# EAGLE design Board (EAGLE 9.5.2)
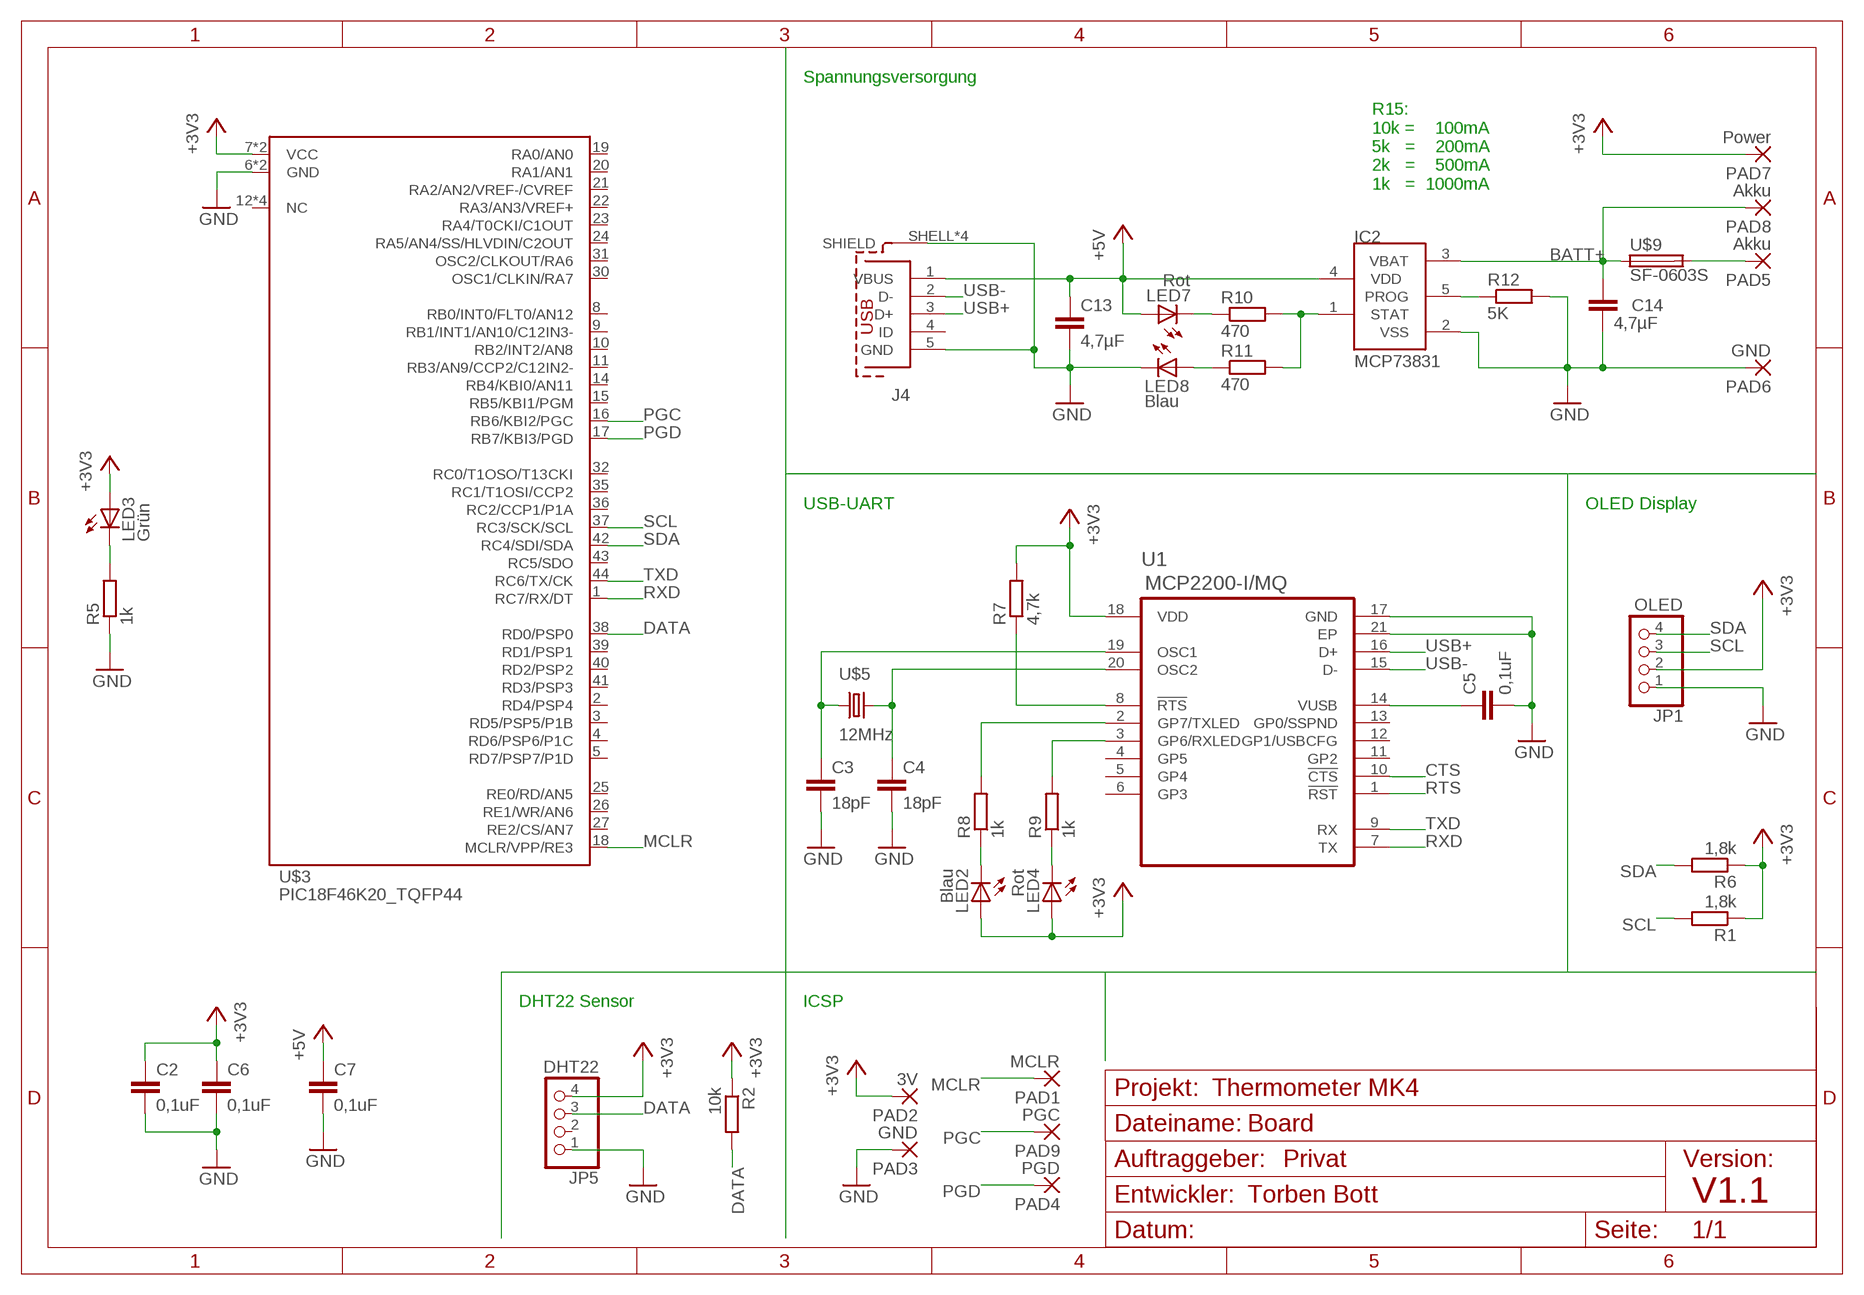
[diagram p0: schematic, sheet 1]

## Parts
C2  0,1uF  C-EUC0805  [C0805]
C3  18pF  C-EUC0805  [C0805]
C4  18pF  C-EUC0805  [C0805]
C5  0,1uF  C-EUC0805  [C0805]
C6  0,1uF  C-EUC0805  [C0805]
C7  0,1uF  C-EUC0805  [C0805]
C13  4,7µF  C-EUC0805  [C0805]
C14  4,7µF  C-EUC0805  [C0805]
IC2  MCP73831  [SOT23-5L]
J4  629105136821  [629105136821]
JP1  OLED  PINHD-1X4  [1X04]
JP5  DHT22  PINHD-1X4  [1X04]
LED2  Blau  LEDCHIPLED_0805  [CHIPLED_0805]
LED3  Grün  LEDCHIPLED_0805  [CHIPLED_0805]
LED4  Rot  LEDCHIPLED_0805  [CHIPLED_0805]
LED7  Rot  LEDCHIPLED_0805  [CHIPLED_0805]
LED8  Blau  LEDCHIPLED_0805  [CHIPLED_0805]
PAD1  MCLR  WIREPADSMD1,27-254  [SMD1,27-2,54]
PAD2  3V  WIREPADSMD1,27-254  [SMD1,27-2,54]
PAD3  GND  WIREPADSMD1,27-254  [SMD1,27-2,54]
PAD4  PGD  WIREPADSMD1,27-254  [SMD1,27-2,54]
PAD5  Akku  WIREPADSMD5-1,8  [5-1,8]
PAD6  GND  WIREPADSMD5-1,8  [5-1,8]
PAD7  Power  WIREPADSMD5-1,8  [5-1,8]
PAD8  Akku  WIREPADSMD5-1,8  [5-1,8]
PAD9  PGC  WIREPADSMD1,27-254  [SMD1,27-2,54]
R1  1,8k  R-EU_R0805  [R0805]
R2  10k  R-EU_R0805  [R0805]
R5  1k  R-EU_R0805  [R0805]
R6  1,8k  R-EU_R0805  [R0805]
R7  4,7k  R-EU_R0805  [R0805]
R8  1k  R-EU_R0805  [R0805]
R9  1k  R-EU_R0805  [R0805]
R10  470  R-EU_R0805  [R0805]
R11  470  R-EU_R0805  [R0805]
R12  5K  R-EU_R0805  [R0805]
U1  MCP2200-I/MQ  [QFN65P500X500X100-21N]
U$3  PIC18F46K20_TQFP44  [TQFP44]
U$5  12MHz  SMD_QUARZ_7M_SERIE  [7M_SERIES]
U$9  SF-0603S  [R0603]

## Nets
+3V3: C2.1 C6.1 JP1.2 JP5.4 LED2.A LED3.A LED4.A PAD2.1(P) PAD7.1(P) R1.1 R2.1 R6.1 R7.2 U1.18(VDD) U$3.7(VCC) U$3.28(VCC)
+5V: C7.1 C13.1 IC2.4(VDD) J4.1(VBUS) LED7.A
BATT+: C14.1 IC2.3(VBAT) PAD8.1(P) U$9.1
CTS: U1.10(!CTS)
DATA: JP5.3 R2.2 U$3.38(RD0/PSP0)
GND: C2.2 C3.2 C4.2 C5.2 C6.2 C7.2 C13.2 C14.2 IC2.2(VSS) J4.5(GND) J4.SHELL1(SHIELD) J4.SHELL2(SHIELD) J4.SHELL3(SHIELD) J4.SHELL(SHIELD) JP1.1 JP5.1 LED8.C PAD3.1(P) PAD6.1(P) R5.1 R12.2 U1.17(GND) U1.21(EP) U$3.6(GND) U$3.29(GND)
MCLR: PAD1.1(P) U$3.18(MCLR/VPP/RE3)
N$7: C4.1 U1.20(OSC2) U$5.3
N$8: LED3.C R5.2
N$9: C3.1 U1.19(OSC1) U$5.1
N$11: R7.1 U1.8(!RTS)
N$13: R8.2 U1.2(GP7/TXLED)
N$14: R9.2 U1.3(GP6/RXLED)
N$15: C5.1 U1.14(VUSB)
N$16: LED2.C R8.1
N$17: LED4.C R9.1
N$28: IC2.1(STAT) R10.2 R11.2
N$29: LED7.C R10.1
N$30: LED8.A R11.1
N$31: IC2.5(PROG) R12.1
N$35: PAD5.1(P) U$9.2
PGC: PAD9.1(P) U$3.16(RB6/KBI2/PGC)
PGD: PAD4.1(P) U$3.17(RB7/KBI3/PGD)
RTS: U1.1(!RST)
RXD: U1.7(TX) U$3.1(RC7/RX/DT)
SCL: JP1.3 R1.2 U$3.37(RC3/SCK/SCL)
SDA: JP1.4 R6.2 U$3.42(RC4/SDI/SDA)
TXD: U1.9(RX) U$3.44(RC6/TX/CK)
USB+: J4.3(D+) U1.16(D+)
USB-: J4.2(D-) U1.15(D-)
Unconnected: J4.4(ID) JP5.2 U1.4(GP5) U1.5(GP4) U1.6(GP3) U1.11(GP2) U1.12(GP1/USBCFG) U1.13(GP0/SSPND) U$3.2(RD4/PSP4) U$3.3(RD5/PSP5/P1B) U$3.4(RD6/PSP6/P1C) U$3.5(RD7/PSP7/P1D) U$3.8(RB0/INT0/FLT0/AN12) U$3.9(RB1/INT1/AN10/C12IN3-) U$3.10(RB2/INT2/AN8) U$3.11(RB3/AN9/CCP2/C12IN2-) U$3.12(NC) U$3.13(NC) U$3.14(RB4/KBI0/AN11) U$3.15(RB5/KBI1/PGM) U$3.19(RA0/AN0) U$3.20(RA1/AN1) U$3.21(RA2/AN2/VREF-/CVREF) U$3.22(RA3/AN3/VREF+) U$3.23(RA4/T0CKI/C1OUT) U$3.24(RA5/AN4/SS/HLVDIN/C2OUT) U$3.25(RE0/RD/AN5) U$3.26(RE1/WR/AN6) U$3.27(RE2/CS/AN7) U$3.30(OSC1/CLKIN/RA7) U$3.31(OSC2/CLKOUT/RA6) U$3.32(RC0/T1OSO/T13CKI) U$3.33(NC) U$3.34(NC) U$3.35(RC1/T1OSI/CCP2) U$3.36(RC2/CCP1/P1A) U$3.39(RD1/PSP1) U$3.40(RD2/PSP2) U$3.41(RD3/PSP3) U$3.43(RC5/SDO)

## Notes on the sheet
- Spannungsversorgung
- R15:
  10k =    100mA
  5k   =    200mA
  2k   =    500mA
  1k   =  1000mA
- USB-UART | OLED Display
- DHT22 Sensor | ICSP
- Thermometer MK4
- Privat
- Torben Bott | V1.1

## Library data of the parts
C2-C7 C13 C14 = rcl:C-EU: CAPACITOR, European symbol; SPICEPREFIX: C
IC2 = microchip-update-2:MCP73831: Miniature Single-Cell, Fully Integrated Li-Ion, Li-Polymer Charge Management Controllers
J4 = InputOutputIO (rev18a):629105136821: WR-COM SMT Horizontal 5 Contacts Micro USB Type B,5 pins=>Code : Con_I-O_COM_MicroUSB_629105136821 <http://katalog.we-online.de/media/images/eican/Con_I-O_COM_MicroUSB_629105136821_pf2.jpg> Details see: http://katalog.we-online.de/en/em/COM_MICRO_SMT_TYPE_B_HORIZONTAL/629105136821?m Created 2014-07-09, Karrer Zheng 2014 (C) Würth Elektronik
JP1 JP5 = pinhead:PINHD-1X4: PIN HEADER
LED2-LED4 LED7 LED8 = led:LED: LED OSRAM: - CHIPLED LG R971, LG N971, LY N971, LG Q971, LY Q971, LO R971, LY R971 LH N974, LH R974 LS Q976, LO Q976, LY Q976 LO Q996 - Hyper CHIPLED LW Q18S LB Q993, LB Q99A, LB R99A - SideLED LS A670, LO A670, LY A670, LG A670, LP A670 LB A673, LV A673, LT A673, LW A673 LH A674 LY A675 LS A676, LA A676, LO A676, LY A676, LW A676 LS A679, LY A679, LG A679 - Hyper Micro SIDELED® LS Y876, LA Y876, LO Y876, LY Y876 LT Y87S - SmartLED LW L88C, LW L88S LB L89C, LB L89S, LG L890 LS L89K, LO L89K, LY L89K LS L896, LA L896, LO L896, LY L896 - TOPLED LS T670, LO T670, LY T670, LG T670, LP T670 LSG T670, LSP T670, LSY T670, LOP T670, LYG T670 LG T671, LOG T671, LSG T671 LB T673, LV T673, LT T673, LW T673 LH T674 LS T676, LA T676, LO T676, LY T676, LB T676, LH T676, LSB T676, LW T676 LB T67C, LV T67C, LT T67C, LS T67K, LO T67K, LY T67K, LW E67C LS E67B, LA E67B, LO E67B, LY E67B, LB E67C, LV E67C, LT E67C LW T67C LS T679, LY T679, LG T679 LS T770, LO T770, LY T770, LG T770, LP T770 LB T773, LV T773, LT T773, LW T773 LH T774 LS E675, LA E675, LY E675, LS T675 LS T776, LA T776, LO T776, LY T776, LB T776 LHGB T686 LT T68C, LB T68C - Hyper Mini TOPLED® LB M676 - Mini TOPLED Santana® LG M470 LS M47K, LO M47K, LY M47K Source: http://www.osram.convergy.de LUXEON: - LUMILED® LXK2-PW12-R00, LXK2-PW12-S00, LXK2-PW14-U00, LXK2-PW14-V00 LXK2-PM12-R00, LXK2-PM12-S00, LXK2-PM14-U00 LXK2-PE12-Q00, LXK2-PE12-R00, LXK2-PE12-S00, LXK2-PE14-T00, LXK2-PE14-U00 LXK2-PB12-K00, LXK2-PB12-L00, LXK2-PB12-M00, LXK2-PB14-N00, LXK2-PB14-P00, LXK2-PB14-Q00 LXK2-PR12-L00, LXK2-PR12-M00, LXK2-PR14-Q00, LXK2-PR14-R00 LXK2-PD12-Q00, LXK2-PD12-R00, LXK2-PD12-S00 LXK2-PH12-R00, LXK2-PH12-S00 LXK2-PL12-P00, LXK2-PL12-Q00, LXK2-PL12-R00 Source: www.luxeon.com KINGBRIGHT: KA-3528ASYC Source: www.kingbright.com
PAD1-PAD9 = wirepad:WIREPAD: Wire PAD connect wire on PCB
R1 R2 R5-R12 = rcl:R-EU_: RESISTOR, European symbol; SPICEPREFIX: R
U1 = Microchip-MCP2200-I_MQ:MCP2200-I/MQ: USB 2.0 to UART Protocol Converter,QFN-20; MPN: MCP2200-I/MQ; OC_FARNELL: 1781147; OC_NEWARK: 52R9946; PACKAGE: QFN-20; SUPPLIER: MICROCHIP
U$3 = Eigene Library:PIC18F46K20_TQFP44: Farnell: 143-9591
U$5 = Eigene Library:SMD_QUARZ_7M_SERIE; FARNELL_12MHZ: 2308719
U$9 = Eigene Library:SF-0603S; FARNELL: 1652144

## Board
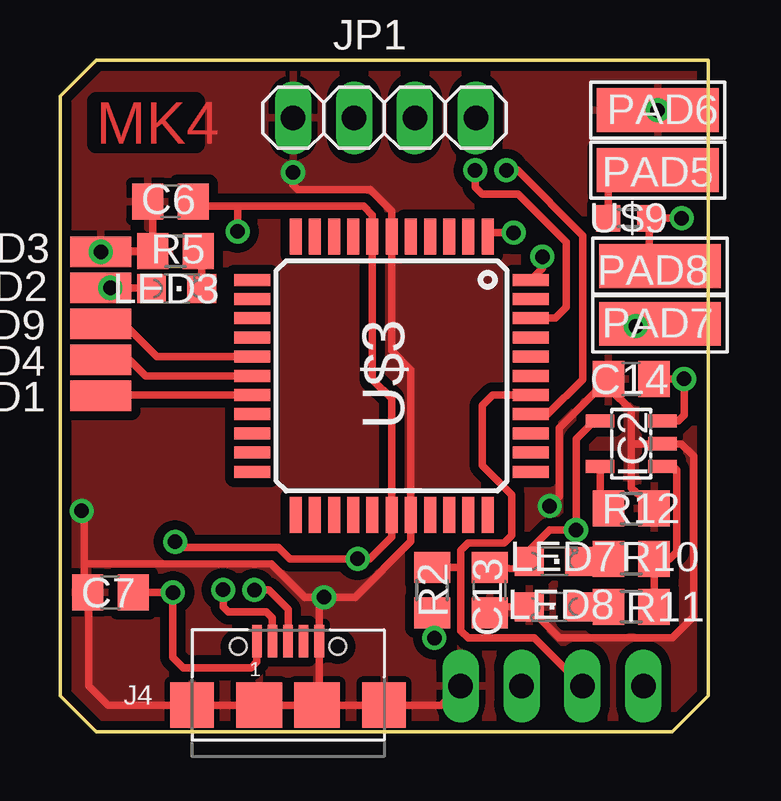
[diagram p1: board, top side]
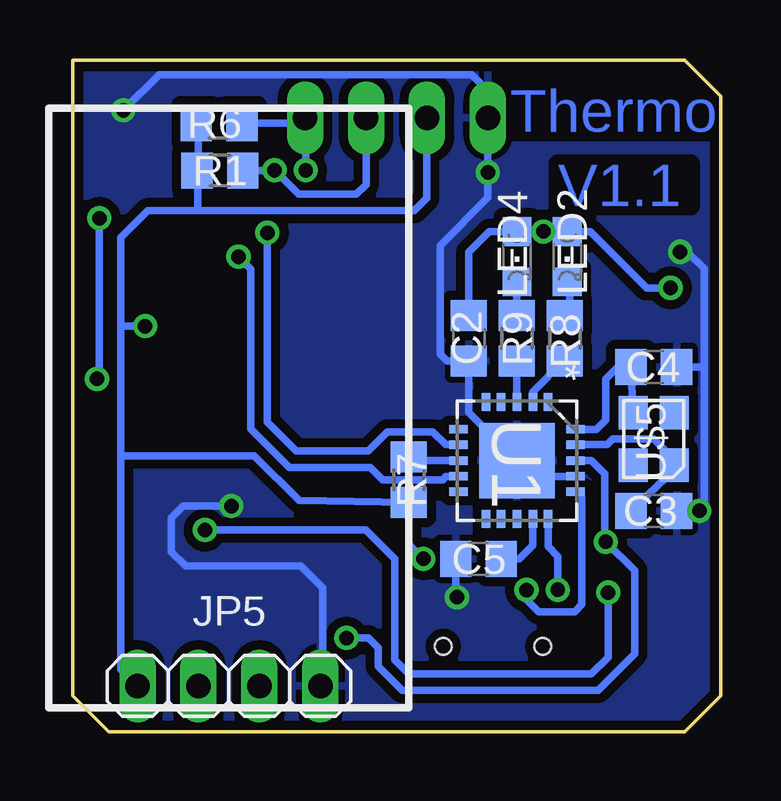
[diagram p2: board, bottom side, seen from below]

Size 27 x 28 mm. Coordinates in mm from the lower left corner, seen from the top.
Outline: 0,26.5 0,1.5 1.5,0 25.5,0 27,1.5 27,28 1.5,28 0,26.5
Copper layers (1*16): Top 0.035mm / dielectric 1.5mm / Bottom 0.035mm
Design rules "Torben": minimum track width 12mil, minimum drill 0.6mm, track to track 15mil, track to pad 8mil, pad to pad 6mil, via to via 6mil, smd to smd 6mil, copper to edge 15mil, drill to drill 6mil, minimum pad ring 10mil, minimum via ring 8mil, stop-mask expansion 4mil, vias tented up to drill 0mil, thermal gap 10mil

### Footprints (pad centres in the part's own frame; a part is rotated, then mirrored left to right if it is on the bottom)
C0805 = smd 1.3 x 1.5: 1 -0.95,0; 2 0.95,0
SOT23-5L = smd 0.55 x 1.2: 1 -0.95,-1.3; 2 0,-1.3; 3 0.95,-1.3; 4 0.95,1.3; 5 -0.95,1.3
629105136821 = smd 0.4 x 1.35: 1 -1.3,2.675; 2 -0.65,2.675; 3 0,2.675; 4 0.65,2.675; 5 1.3,2.675 | smd 1.8 x 1.9: SHELL -4,0; SHELL3 4,0 | smd 1.9 x 1.9: SHELL1 -1.2,0; SHELL2 1.2,0 | hole 0.7: -2.075,2.45; 2.075,2.45
1X04 = drill 1.016 long: 1 -3.81,0; 2 -1.27,0; 3 1.27,0; 4 3.81,0
CHIPLED_0805 = smd 1.2 x 1.2: A 0,-1.05; C 0,1.05
SMD1,27-2,54 = smd 1.27 x 2.54: 1 0,0
5-1,8 = smd 1.829 x 5.08: 1 0,0
R0805 = smd 1.3 x 1.5: 1 -0.95,0; 2 0.95,0
QFN65P500X500X100-21N = smd 0.762 x 0.356: 1 -2.438,1.295; 2 -2.438,0.66; 3 -2.438,0; 4 -2.438,-0.66; 5 -2.438,-1.295; 11 2.438,-1.295; 12 2.438,-0.66; 13 2.438,0; 14 2.438,0.66; 15 2.438,1.295 | smd 0.356 x 0.762: 6 -1.295,-2.438; 7 -0.66,-2.438; 8 0,-2.438; 9 0.66,-2.438; 10 1.295,-2.438; 16 1.295,2.438; 17 0.66,2.438; 18 0,2.438; 19 -0.66,2.438; 20 -1.295,2.438 | smd 3.15 x 3.15: 21 0,0
TQFP44 = smd 1.5 x 0.5: 1 -5.8,4; 2 -5.8,3.2; 3 -5.8,2.4; 4 -5.8,1.6; 5 -5.8,0.8; 6 -5.8,0; 7 -5.8,-0.8; 8 -5.8,-1.6; 9 -5.8,-2.4; 10 -5.8,-3.2; 11 -5.8,-4; 23 5.8,-4; 24 5.8,-3.2; 25 5.8,-2.4; 26 5.8,-1.6; 27 5.8,-0.8; 28 5.8,0; 29 5.8,0.8; 30 5.8,1.6; 31 5.8,2.4; 32 5.8,3.2; 33 5.8,4 | smd 0.5 x 1.5: 12 -4,-5.8; 13 -3.2,-5.8; 14 -2.4,-5.8; 15 -1.6,-5.8; 16 -0.8,-5.8; 17 0,-5.8; 18 0.8,-5.8; 19 1.6,-5.8; 20 2.4,-5.8; 21 3.2,-5.8; 22 4,-5.8; 34 4,5.8; 35 3.2,5.8; 36 2.4,5.8; 37 1.6,5.8; 38 0.8,5.8; 39 0,5.8; 40 -0.8,5.8; 41 -1.6,5.8; 42 -2.4,5.8; 43 -3.2,5.8; 44 -4,5.8
7M_SERIES = smd 1.4 x 1.2: 1 -1.1,-0.85; 2 1.1,-0.85; 3 1.1,0.85; 4 -1.1,0.85
R0603 = smd 1 x 1.1: 1 -0.85,0; 2 0.85,0

### Placement (x,y rotation side)
C2  10.5,16.4 270 bottom
C3  2.8,9.2 0 bottom
C4  2.8,15.2 0 bottom
C5  10.1,7.2 180 bottom
C6  4.6,22.1 180 top
C7  2.1,5.8 180 top
C13  17.9,5.9 270 top
C14  23.8,14.7 180 top
IC2  23.8,12 90 top
J4  9.5,1.1 0 top
JP1  13.52,25.59 0 top
JP5  20.5,1.9 180 bottom
LED2  6.4,19.8 180 bottom
LED3  4.86,18.47 270 top
LED4  8.5,19.8 180 bottom
LED7  20.6,7.1 270 top
LED8  20.6,5.2 90 top
PAD1  1.7,14 90 top
PAD2  1.7,18.5 90 top
PAD3  1.7,20 90 top
PAD4  1.7,15.5 90 top
PAD5  24.9,23.4 90 top
PAD6  24.9,25.9 90 top
PAD7  25,17 90 top
PAD8  25,19.4 90 top
PAD9  1.7,17 90 top
R1  20.88,23.39 0 bottom
R2  15.5,5.9 90 top
R5  4.81,20.03 0 top
R6  20.91,25.37 0 bottom
R7  13,10.5 270 bottom
R8  6.5,16.4 270 bottom
R9  8.5,16.4 270 bottom
R10  23.8,7.2 0 top
R11  23.8,5.2 0 top
R12  23.8,9.3 0 top
U1  8.5,11.3 270 bottom
U$3  13.82,14.83 270 top
U$5  2.8,12.2 90 bottom
U$9  23.7,21.4 180 top

### Tracks (layer width: path | path; a pad name or v marks a point on that pad's centre or on a via)
+3V3  (via drill 0.6)
  Top 0.305: v4.8,7.91 5.02,7.69 9.08,7.69 9.57,7.2 v12.4,7.2 12.9,7.2 13.82,8.12 U$3.28 13.82,13.88 13.02,14.68 U$3.7 13.02,21.53 12.65,21.9 7.3,21.9 | LED3.A 3.78,18.5 v2.1,18.5 PAD2.1 | C6.1 5.65,21.9 7.3,21.9 | v7.4,20.85 7.4,21.8 7.3,21.9 | PAD7.1 24.09,17 v23.99,16.9 | R2.1 15.5,4 v15.6,3.9
  Bottom 0.305: U1.18 5.4,11.3 4.84,10.74 4.84,7.95 v4.8,7.91 | C2.1 10.5,20 9.65,20.85 LED4.A v7.4,20.85 LED2.A 5.45,20.85 3.1,18.5 v2.1,18.5 | v12.4,7.2 13,7.8 R7.2 17.58,9.64 19.44,11.5 25,11.5 | 4.8,8.01 v4.8,7.91 | R6.1 21.73,25.34 R1.1 21.8,23.32 21.8,21.71 | JP1.2 12.25,22.25 12.79,21.71 21.8,21.71 | 21.8,21.71 23.89,21.71 25,20.6 25,16.8 | v4.8,7.91 3.6,6.71 3.6,3.23 5.12,1.71 13.28,1.71 14.29,2.72 14.29,3.49 14.7,3.9 v15.6,3.9 | JP5.4 25,2.59 25,11.5 | 25,11.5 25,16.8 | v23.99,16.9 24.9,16.9 25,16.8
+5V  (via drill 0.6)
  Top 0.305: J4.1 8.2,2.9 7.97,2.67 5.13,2.67 4.7,3.1 v4.7,5.8 C7.1 | 17.95,6.7 C13.1 19.13,6.77 LED7.A 19.55,7.55 20.4,8.4 v21.5,8.4 21.5,12.2 22.25,12.95 IC2.4
  Bottom 0.305: v4.7,5.8 4.7,3.1 5.4,2.4 13,2.4 13.6,3 13.6,7.2 14.8,8.4 v21.5,8.4
BATT+  (via drill 0.6)
  Top 0.305: v25.9,21.4 U$9.1 24.55,19.85 PAD8.1 | IC2.3 25.75,12.95 26,13.2 v26,14.7 C14.1
  Bottom 0.305: v26,14.7 25.9,14.8 v25.9,21.4
DATA
  Top 0.305: U$3.38 18.03,14.03 17.6,13.6 17.6,11.1 18.83,9.87 18.83,8.19 18.5,7.86 17,7.86 16.7,7.55 16.7,6.8 | JP5.3 19.77,3.9 17,3.9 16.7,4.2 16.7,6.8 | R2.2 16.65,6.85 16.7,6.8
GND  (via drill 0.6)
  Top 0.305: R5.1 3.66,20.03 | 10.8,1.2 J4.5 10.8,5.4 v11,5.6 | 10.8,1.2 J4.SHELL2 J4.SHELL1 J4.SHELL 2,1.1 1.2,1.9 1.2,5.8 1.23,5.83 | 10.8,1.2 10.9,1.1 J4.SHELL3 15.89,1.1 JP5.1 | v11,5.6 10.2,5.6 8.8,7 1,7 | PAD3.1 1.73,20.03 R5.1 | R5.1 3.87,21.94 C6.2 | 1.23,5.83 1,6.05 1,7 | 1.23,5.83 C7.2 | v0.9,9.2 1,9.1 1,7 | 23.8,12 IC2.2 25.89,12 26.4,11.49 26.4,4.8 25.5,3.9 20.8,3.9 19.55,5.15 LED8.C 17.98,5.2 C13.2 17.65,5.3 | 23.8,12 23.8,10.15 R12.2 | 23.8,12 23.8,13.4 22.95,14.25 C14.2 20.8,12.65 20.8,9.8 v20.4,9.4 | v9.71,23.31 v9.7,23.3 9.7,22.8 9.91,22.59 12.93,22.59 13.82,21.7 U$3.6 13.82,15.88 14.62,15.08 U$3.29 14.62,7.92 12.3,5.6 v11,5.6
  Bottom 0.305: 1.7,9.2 C3.2 v0.9,9.2 0.7,9.4 0.7,15.2 | 1.7,15.2 C4.2 0.7,15.2 | U1.17 7.84,10.64 U1.21 10.5,13.3 C2.2 11.4,15.45 11.7,15.75 11.7,20.27 9.71,22.26 v9.71,23.31 JP1.1 9.71,26.71 10.39,27.39 23.41,27.39 PAD6.1 | C5.2 11.05,5.65 v11,5.6 | PAD3.1 1.4,20 0.7,19.3 0.7,15.2 | v20.4,9.4 22.4,9.4 22.9,8.9 22.9,7.5 22.3,6.9 17.5,6.9 16.6,6 16.6,1.99 JP5.1
  other vias: 1.7,20 24.9,25.9
  pour Bottom: 25.5,0 1.5,0 0,1.5 0,26.5 1.5,28 27,28 27,1.5
  pour Top: 25.5,0 1.5,0 0,1.5 0,26.5 1.5,28 27,28 27,1.5
MCLR
  Top 0.305: U$3.18 1.73,14.03 PAD1.1
N$7
  Bottom 0.305: U$5.3 C4.1 4.3,15.2 4.8,14.7 4.8,13 5.2,12.59 U1.20
N$8
  Top 0.305: LED3.C 5.91,19.84 R5.2
N$9
  Bottom 0.305: U$5.1 1.95,10.8 | U$5.1 1.95,11.35 2.8,12.2 4.5,12.2 4.74,11.96 U1.19 | C3.1 1.95,10.9 U$5.1
N$11
  Bottom 0.305: U1.8 12.95,11.3 R7.1
N$13
  Bottom 0.305: U1.2 7.84,14.16 6.54,15.46 R8.2
N$14
  Bottom 0.305: U1.3 R9.2
N$15
  Bottom 0.305: U1.14 7.84,7.76 8.4,7.2 C5.1
N$16
  Bottom 0.305: R8.1 6.3,17.55 6.3,18.65 LED2.C
N$17
  Bottom 0.305: R9.1 LED4.C
N$28
  Top 0.305: IC2.1 25.55,11.05 25.7,10.9 25.7,7.5 25.4,7.2 R10.2 R11.2
N$29
  Top 0.305: R10.1 22.75,7.1 LED7.C
N$30
  Top 0.305: LED8.A R11.1
N$31
  Top 0.305: IC2.5 22.5,9.75 R12.1
N$35
  Top 0.305: 24.9,23.2 PAD5.1 23.1,23.4 22.85,23.15 U$9.2
PGC
  Top 0.305: U$3.16 4.04,15.63 2.67,17 PAD9.1
PGD
  Top 0.305: U$3.17 3.57,14.83 2.9,15.5 PAD4.1
RXD  (via drill 0.6)
  Top 0.305: 17.82,21.12 U$3.1 17.99,20.8 v18.9,20.8
  Bottom 0.305: U1.7 11.46,11.96 12,12.5 13.9,12.5 14.7,11.7 17.7,11.7 18.9,12.9 v18.9,20.8
SCL  (via drill 0.6)
  Top 0.305: U$3.37 20.33,13.23 21.79,14.69 21.79,20.68 19.07,23.4 v18.6,23.4
  Bottom 0.305: JP1.3 14.79,22.81 15.2,22.4 17.6,22.4 v18.6,23.4 v18.61,23.39 R1.2
SDA  (via drill 0.6)
  Top 0.305: U$3.42 20.63,17.23 21.1,17.7 21.1,20.4 19.09,22.41 17.59,22.41 17.3,22.7 v17.3,23.4
  Bottom 0.305: v17.3,23.4 17.3,25.56 | 17.3,25.56 JP1.4 | R6.2 17.49,25.37 17.3,25.56
TXD  (via drill 0.6)
  Top 0.305: U$3.44 20.1,19.31 v20.1,19.8
  Bottom 0.305: U1.9 11.46,10.64 11.6,10.5 14.1,10.5 14.61,11.01 17.98,11.01 19.59,12.62 19.59,19.29 v20.1,19.8
USB+  (via drill 0.6)
  Top 0.305: J4.3 9.5,5.1 8.7,5.9 v8.1,5.9
  Bottom 0.305: v8.1,5.9 8.1,5.5 7.6,5 6.1,5 5.8,5.3 5.8,9.74 U1.16
USB-  (via drill 0.6)
  Top 0.305: J4.2 8.85,4.75 8.6,5 7,5 6.8,5.2 v6.8,5.91
  Bottom 0.305: U1.15 7.2,7.71 6.8,7.31 v6.8,5.91

### Text on the board
Top: MK4
Bottom: Thermo | V1.1